# Altium project mV_Meter.PrjPcb (part 1 of 2)
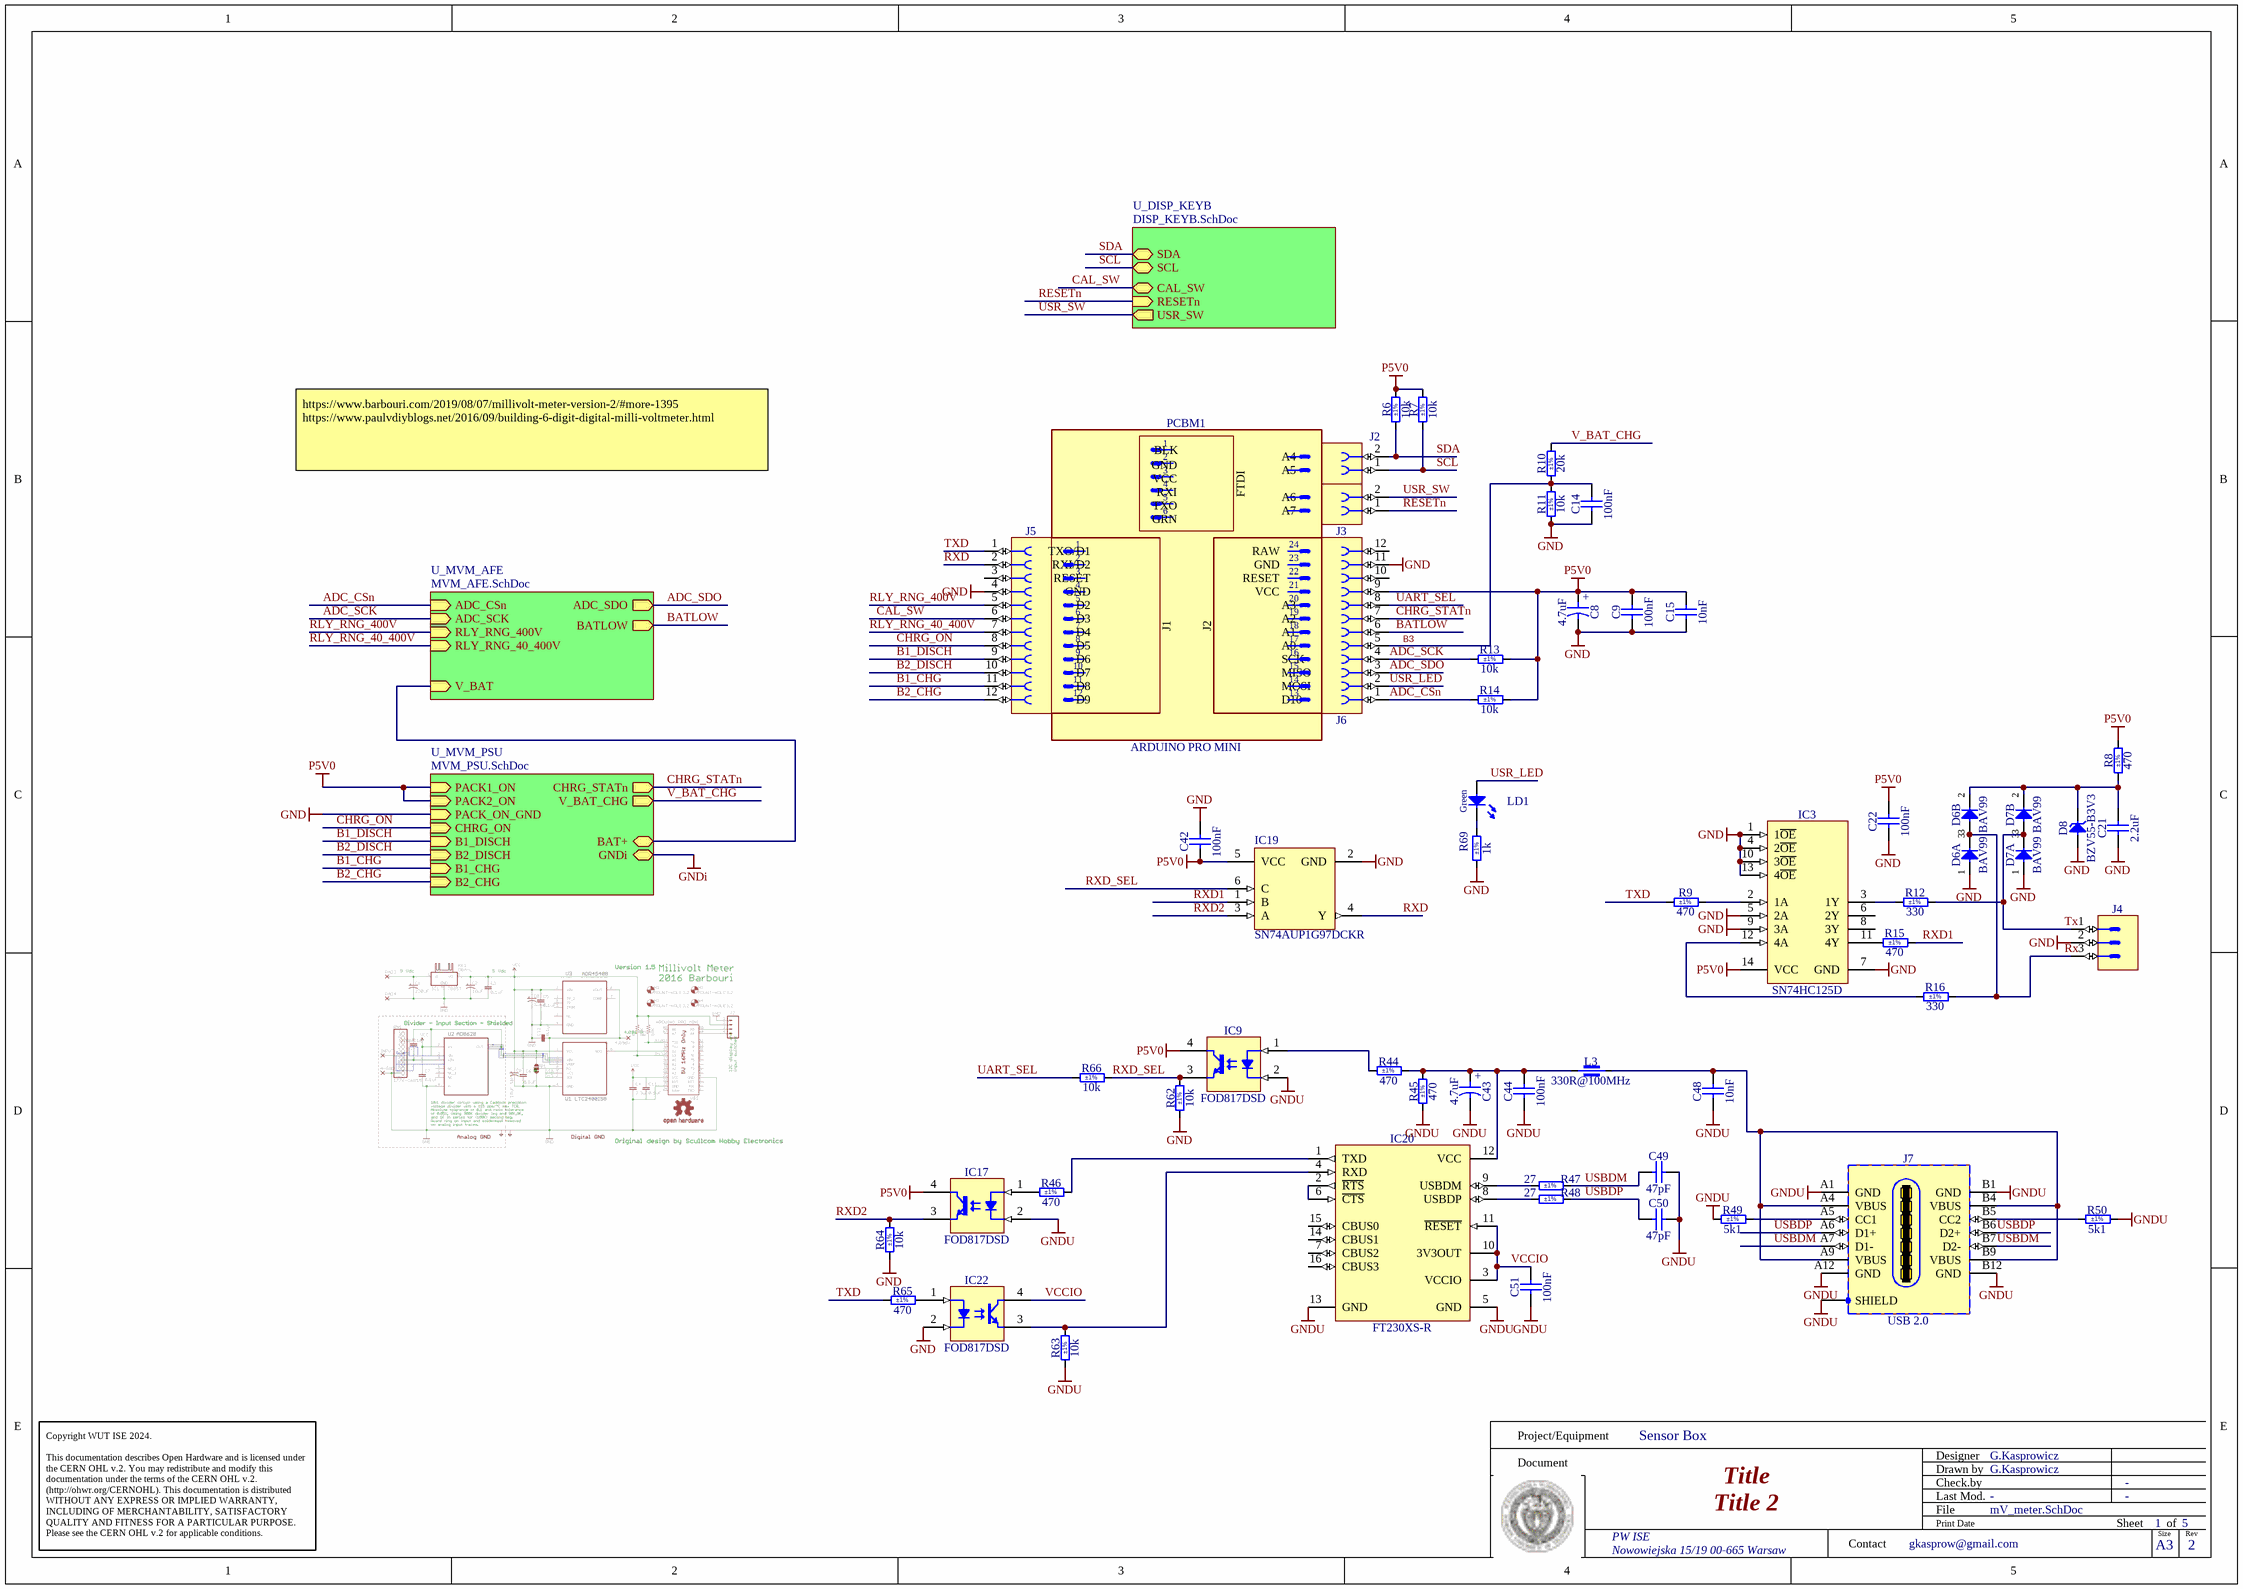
[diagram p0: mV_meter.SchDoc]
5 sheets, 260 parts. Net scope: hierarchical (ports join the sheet entries above them; power ports are global).
Board file: mV_meter.PcbDoc
Sheets:
  mV_meter.SchDoc
    U_MVM_PSU = MVM_PSU.SchDoc
      U_MVM_BMS = MVM_BMS.SchDoc
      U_MVM_BMS = MVM_BMS.SchDoc
    U_DISP_KEYB = DISP_KEYB.SchDoc
    U_MVM_AFE = MVM_AFE.SchDoc

## Sheet mV_meter.SchDoc: Title
size 420 x 297 mm; Author: G.Kasprowicz; CompanyName: WUT ISE; DrawnBy: G.Kasprowicz; Organization: WUT ISE; Address1: PW ISE; Address2: Nowowiejska 15/19 00-665 Warsaw; Address3: gkasprow@gmail.com; Revision: 2; SheetNumber: 1; SheetTotal: 5; ModifiedBy: -; CheckedDate: -; Title2: Title 2; DivGrp: WUT ISE; Designer: G.Kasprowicz; ModifiedDate: -; ProjectName: Sensor Box

### Parts
(Parts that share a designator on the sheet are numbered #1, #2 ... from top to bottom, then left to right.)
C8  4.7uF  [CAPMP3216X180N]
C9  100nF  [CAPC2012X88N]
C14  100nF  [CAPC2012X88N]
C15  10nF  [CAPC2012X135N]
C21  2.2uF  [CAPC1608X90N]
C22  100nF  [CAPC1608X90N]
C42  100nF  [CAPC1608X90N]
C43  4.7uF  [CAPMP3216X180N]
C44  100nF  [CAPC1608X90N]
C48  10nF  [CAPC2012X135N]
C49  47pF  [CAPC1608X87N]
C50  47pF  [CAPC1608X87N]
C51  100nF  [CAPC1608X90N]
D6  BAV99  [SOT95P240X110-3N]  (parts A,B of 2)
D7  BAV99  [SOT95P240X110-3N]  (parts A,B of 2)
D8  BZV55-B3V3  [DIOMELF3515N]
IC3#1  SN74HC125D  [SOIC127P600X175-14N]
IC9  FOD817DSD  [FAIRCHILD_FOD817DSD]
IC17#1  FOD817DSD  [FAIRCHILD_FOD817DSD]
IC19  SN74AUP1G97DCKR  [DCK0006A_M]
IC20  FT230XS-R  [SOP63P600X175-16N]
IC22  FOD817DSD  [FAIRCHILD_FOD817DSD]
J2#1  Socket 2  [SAMTEC_SSW-102-02-G-S]  (value not drawn)
J3  Socket 2  [SAMTEC_SSW-102-02-G-S]  (value not drawn)
J4#1  (no value)  [PHOENIX_1803280]
J5  Socket 12  [SAMTEC_SSW-112-01-G-S]  (value not drawn)
J6  Socket 12  [SAMTEC_SSW-112-01-G-S]  (value not drawn)
J7  USB 2.0  [KYCON_KUSBX-SL-CS1N14-B]
L3  330R@100MHz  [INDC1608X75N]
LD1  Green  [LED_AVAGO_HSME-C110]
PCBM1  ARDUINO PRO MINI  [PCBM_ARDUINO PRO MINI]
R6  10k  Tolerance: ±1%  [RESC1608X55N]
R7#1  10k  Tolerance: ±1%  [RESC1608X55N]
R8  470  Tolerance: ±1%  [RESC1608X55N]
R9  470  Tolerance: ±1%  [RESC1608X55N]
R10  20k  Tolerance: ±1%  [RESC1608X55N]
R11  10k  Tolerance: ±1%  [RESC1608X55N]
R12  330  Tolerance: ±1%  [RESC1608X55N]
R13  10k  Tolerance: ±1%  [RESC1608X55N]
R14  10k  Tolerance: ±1%  [RESC1608X55N]
R15  470  Tolerance: ±1%  [RESC1608X55N]
R16  330  Tolerance: ±1%  [RESC1608X55N]
R44  470  Tolerance: ±1%  [RESC1608X55N]
R45  470  Tolerance: ±1%  [RESC1608X55N]
R46  470  Tolerance: ±1%  [RESC1608X55N]
R47  27  Tolerance: ±1%  [RESC1608X55N]
R48  27  Tolerance: ±1%  [RESC1608X55N]
R49  5k1  Tolerance: ±1%  [RESC1608X55N]
R50  5k1  Tolerance: ±1%  [RESC1608X55N]
R62  10k  Tolerance: ±1%  [RESC1608X55N]
R63  10k  Tolerance: ±1%  [RESC1608X55N]
R64  10k  Tolerance: ±1%  [RESC1608X55N]
R65  470  Tolerance: ±1%  [RESC1608X55N]
R66  10k  Tolerance: ±1%  [RESC1608X55N]
R69  1k  Tolerance: ±1%  [RESC1608X55N]

### Sub-sheets
U_DISP_KEYB = DISP_KEYB.SchDoc: SDA (bidir), SCL (bidir), CAL_SW (bidir), RESETn (in), USR_SW (out)
U_MVM_AFE = MVM_AFE.SchDoc: ADC_CSn (in), ADC_SCK (in), ADC_SDO (out), RLY_RNG_400V (in), RLY_RNG_40_400V (in), BATLOW (out), V_BAT (in)
U_MVM_PSU = MVM_PSU.SchDoc: PACK1_ON (in), PACK2_ON (in), PACK_ON_GND (in), CHRG_ON (in), CHRG_STATn (out), B1_DISCH (in), B2_DISCH (in), B1_CHG (in), B2_CHG (in), BAT+ (bidir), GNDi (bidir), V_BAT_CHG (out)

### Nets
GND: C8.2 C9.1 C14.1 C15.1 C21.1 C22.1 C42.1 D6.1(A) D7.1(A) D8.2(A) IC3#1.1(1~{OE}) IC3#1.4(2~{OE}) IC3#1.5(2A) IC3#1.7(GND) IC3#1.9(3A) IC3#1.10(3~{OE}) IC3#1.13(4~{OE}) IC19.2(GND) IC22.2(C) J4#1.2 J5.4 J6.11 R11.1 R62.1 R64.1 R69.1 ; sheet U_MVM_PSU/PACK_ON_GND
GNDU: C43.2 C44.1 C48.1 C49.2 C50.2 C51.1 IC9.2(C) IC17#1.2(C) IC20.5(GND) IC20.13(GND) J7.A1(GND) J7.A12(GND) J7.B1(GND) J7.B12(GND) J7.SHIELD R45.1 R49.1 R50.2 R63.1
P5V0: C8.1 C9.2 C15.2 C22.2 C42.2 IC3#1.14(VCC) IC9.4(C) IC17#1.4(C) IC19.5(VCC) J6.9 R6.2 R7#1.2 R8.2 R13.2 R14.2 ; sheet U_MVM_PSU/PACK1_ON, sheet U_MVM_PSU/PACK2_ON
ADC_CSn: J6.1 R14.1 ; sheet U_MVM_AFE/ADC_CSn
ADC_SCK: J6.4 R13.1 ; sheet U_MVM_AFE/ADC_SCK
ADC_SDO: J6.3 ; sheet U_MVM_AFE/ADC_SDO
B1_CHG: J5.11 ; sheet U_MVM_PSU/B1_CHG
B1_DISCH: J5.9 ; sheet U_MVM_PSU/B1_DISCH
B2_CHG: J5.12 ; sheet U_MVM_PSU/B2_CHG
B2_DISCH: J5.10 ; sheet U_MVM_PSU/B2_DISCH
B3: C14.2 J6.5 R10.1 R11.2
BAT+: sheet U_MVM_PSU/BAT+, sheet U_MVM_AFE/V_BAT
BATLOW: J6.6 ; sheet U_MVM_AFE/BATLOW
CAL_SW: J5.6 ; sheet U_DISP_KEYB/CAL_SW
CHRG_ON: J5.8 ; sheet U_MVM_PSU/CHRG_ON
CHRG_STATn: J6.7 ; sheet U_MVM_PSU/CHRG_STATn
RESETn: J3.1 ; sheet U_DISP_KEYB/RESETn
RLY_RNG_40_400V: J5.7 ; sheet U_MVM_AFE/RLY_RNG_40_400V
RLY_RNG_400V: J5.5 ; sheet U_MVM_AFE/RLY_RNG_400V
Rx: D6.3(COMAC) J4#1.3 R16.2
RXD: IC19.4(Y) J5.2
RXD1: IC19.1(B) R15.2
RXD2: IC17#1.3(E) IC19.3(A) R64.2
RXD_SEL: IC9.3(E) IC19.6(C) R62.2 R66.2
SCL: J2#1.1 R7#1.1 ; sheet U_DISP_KEYB/SCL
SDA: J2#1.2 R6.1 ; sheet U_DISP_KEYB/SDA
Tx: D7.3(COMAC) J4#1.1 R12.2
TXD: J5.1 R9.1 R65.1
UART_SEL: J6.8 R66.1
USBDM: C49.1 J7.A7(D1-) J7.B7(D2-) R47.2
USBDP: C50.1 J7.A6(D1+) J7.B6(D2+) R48.2
USR_LED: J6.2 LD1.2(A)
USR_SW: J3.2 ; sheet U_DISP_KEYB/USR_SW
V_BAT_CHG: R10.2 ; sheet U_MVM_PSU/V_BAT_CHG
VCCIO: C51.2 IC20.3(VCCIO) IC20.10(3V3OUT) IC20.11(~{RESET}) IC22.4(C)
NetC21_2: C21.2 D6.2(C) D7.2(C) D8.1(C) R8.1
NetC43_1: C43.1 C44.2 IC20.12(VCC) L3.1 R44.2 R45.2
NetC48_2: C48.2 J7.A4(VBUS) J7.A9(VBUS) J7.B4(VBUS) J7.B9(VBUS) L3.2
NetIC3#1_2: IC3#1.2(1A) R9.2
NetIC3#1_3: IC3#1.3(1Y) R12.1
NetIC3#1_11: IC3#1.11(4Y) R15.1
NetIC3#1_12: IC3#1.12(4A) R16.1
NetIC9_1: IC9.1(A) R44.1
NetIC17#1_1: IC17#1.1(A) R46.1
NetIC20_1: IC20.1(TXD) R46.2
NetIC20_2: IC20.2(~{RTS}) IC20.6(~{CTS})
NetIC20_4: IC20.4(RXD) IC22.3(E) R63.2
NetIC20_8: IC20.8(USBDP) R48.1
NetIC20_9: IC20.9(USBDM) R47.1
NetIC22_1: IC22.1(A) R65.2
NetJ7_A5: J7.A5(CC1) R49.2
NetJ7_B5: J7.B5(CC2) R50.1
NetLD1_1: LD1.1(C) R69.2

Not connected (* = marked no-connect by the designer): IC3#1 6(2Y) 8(3Y); IC20 7(CBUS2) 14(CBUS1) 15(CBUS0) 16(CBUS3); J5 3; J6 10 12

### Notes on the sheet
- https://www.barbouri.com/2019/08/07/millivolt-meter-version-2/#more-1395
  https://www.paulvdiyblogs.net/2016/09/building-6-digit-digital-milli-voltmeter.html
- Project/Equipment
- Document
- Designer
- Drawn by
- Check.by
- Copyright WUT ISE 2024.
  This documentation describes Open Hardware and is licensed under the CERN OHL v.2. You may redistribute and modify this documentation under the terms of the CERN OHL v.2. (http://ohwr.org/CERNOHL). This documentation is distributed WITHOUT ANY EXPRESS OR IMPLIED WARRANTY, INCLUDING OF MERCHANTABILITY, SATISFACTORY QUALITY AND FITNESS FOR A PARTICULAR PURPOSE. Please see the CERN OHL v.2 for applicable conditions.
- Contact
- File
- Last Mod.
- Print Date
- Sheet
- Size
- A3
- of
- Rev
- (in symbol CTE3216-18_4.7UF_10V_10%_LESR1400) +
- (in symbol PCBM_ARDUINO PRO MINI extra pins) 1; BLK; 2; A4; GND; 3; A5; VCC; 4; FTDI; RXI; 5; A6; TXO; 6; A7; GRN; 24; TXO/D1; RAW; 23; RXI/D2; 22; RESET; 21; 20; D2; A3; 19; D3; A2; 7; J1; J2; 18; D4; A1; 8; 17; D5; A0; 9; 16; D6; SCK; 10; 15; D7; MISO; 11; 14; D8; MOSI; 12; 13; D9; D10

### Library data of the parts
C8 C43 = CTE3216-18_4.7UF_10V_10%_LESR1400: Polarised capacitor; Part Description: Low ESR 1R4 Solid Tantalum Chip Capacitor; Manufacturer: GENERIC; Manufacturer1 Part Number: TPSA475K010R1400; Voltage: 10V; Tolerance: ±10%; Part Number: CTE3216-18_4.7UF_10V_10%_LESR1400; Component Kind: Standard; Component Type: Standard; Pin Count: 2; Value: 4.7uF; Status: Preferred; Manufacturer Part Number: CTE3216-18_4.7UF_10V_10%_LESR1400; Case: A; Mounted: Yes; Socket: No; SMD: Yes; Sense: No; Manufacturer1 Example: AVX; Manufacturer1 ComponentHeight: 1.8mm; HelpURL: \\cern.ch\dfs\Applications\Altium\Datasheets\CTE-LESR_AVX_TPS.pdf; Author: CERN DEM JLC; CreateDate: 05.05.2008; LatestRevisionDate: 20.01.2009
C9 C14 = CC0805_100NF_50V_1%_NP0: Non-polarised capacitor; Part Description: SMD Multilayer Chip Ceramic Capacitor; Manufacturer: GENERIC; Manufacturer1 Part Number: 0805N103F500C; Voltage: 50V; TC: C0G/NP0; Tolerance: ±1%; Part Number: CC0805_100NF_50V_1%_NP0; Component Kind: Standard; Component Type: Standard; Footprint: CAPC2012X135N; Pin Count: 2; Value: 100nF; Status: Not Recommended; Manufacturer Part Number: CC0805_100NF_50V_1%_NP0; Case: 0805; Mounted: Yes; Socket: No; SMD: Yes; Sense: No; ComponentHeight: 1.35mm; Manufacturer1 Example: WALSIN TECHNOLOGY CORPORATION; Manufacturer1 ComponentHeight: 1.35mm; HelpURL: \\cern.ch\dfs\Applications\Altium\Datasheets\CC0805_WALSIN_0805.pdf; Author: CERN DEM HF; CreateDate: 28.08.2023; LatestRevisionDate: 28.08.2023
C15 C48 = CC0805_10NF_50V_5%_C0G: Non-polarised capacitor; Part Description: SMD Multilayer Chip Ceramic Capacitor; Manufacturer: GENERIC; Manufacturer1 Part Number: C0805C103J5GACTU; Voltage: 50V; TC: C0G/NP0; Tolerance: ±5%; Part Number: CC0805_10NF_50V_5%_C0G; Component Kind: Standard; Component Type: Standard; Pin Count: 2; Value: 10nF; Status: None; Manufacturer Part Number: CC0805_10NF_50V_5%_C0G; Case: 0805; Mounted: Yes; Socket: No; SMD: Yes; Sense: No; Manufacturer1 Example: KEMET; Manufacturer1 ComponentHeight: 0.88mm; HelpURL: \\cern.ch\dfs\Applications\Altium\Datasheets\CC0805_C0G_KEMET_(Commercial Grade).pdf; Author: CERN DEM JLC; CreateDate: 02.02.2011; LatestRevisionDate: 22.04.2015
C21 = CC0603_2.2UF_10V_20%_X7R: Non-polarised capacitor; Part Description: SMD Multilayer Chip Ceramic Capacitor; Manufacturer: GENERIC; Manufacturer1 Part Number: LMK107B7225MA-T; Voltage: 10V; TC: X7R; Tolerance: ±20%; Part Number: CC0603_2.2UF_10V_20%_X7R; Component Kind: Standard; Component Type: Standard; Pin Count: 2; Value: 2.2uF; Status: Not Recommended; Manufacturer Part Number: CC0603_2.2UF_10V_20%_X7R; Case: 0603; Mounted: Yes; Socket: No; SMD: Yes; Sense: No; Manufacturer1 Example: TAIYO YUDEN; Manufacturer1 ComponentHeight: 0.9mm; HelpURL: \\cern.ch\dfs\Applications\Altium\Datasheets\CC0603_X7R_TAIYO-YUDEN_HIGH-VALUE.pdf; Author: CERN DEM JLC; CreateDate: 22.06.2011; LatestRevisionDate: 27.06.2011
C22 C42 C44 C51 = CC0603_100NF_100V_10%_X7R: Non-polarised capacitor; Part Description: SMD Multilayer Chip Ceramic Capacitor; Manufacturer: GENERIC; Manufacturer1 Part Number: GRM188R72A104KA35D; Voltage: 100V; TC: X7R; Tolerance: ±10%; Part Number: CC0603_100NF_100V_10%_X7R; Component Kind: Standard; Component Type: Standard; Pin Count: 2; Value: 100nF; Status: None; Manufacturer Part Number: CC0603_100NF_100V_10%_X7R; Case: 0603; Mounted: Yes; Socket: No; SMD: Yes; Sense: No; Manufacturer1 Example: MURATA; Manufacturer1 ComponentHeight: 0.9mm; HelpURL: \\cern.ch\dfs\Applications\Altium\Datasheets\CC0603_MURATA_GRM188R72A104KA35D.pdf; Author: CERN DEM JLC; CreateDate: 11.12.2013; LatestRevisionDate: 11.12.2013
C49 C50 = CC0603_47PF_50V_5%_NP0: Non-polarised capacitor; Part Description: SMD Multilayer Chip Ceramic Capacitor; Manufacturer: GENERIC; Manufacturer1 Part Number: 223886715479; Voltage: 50V; TC: C0G/NP0; Tolerance: ±5%; Part Number: CC0603_47PF_50V_5%_NP0; Component Kind: Standard; Component Type: Standard; Pin Count: 2; Value: 47pF; Status: Preferred; Manufacturer Part Number: CC0603_47PF_50V_5%_NP0; Case: 0603; Mounted: Yes; Socket: No; SMD: Yes; Sense: No; Manufacturer1 Example: PHYCOMP; Manufacturer1 ComponentHeight: 0.87mm; HelpURL: \\cern.ch\dfs\Applications\Altium\Datasheets\CC0603_NP0_PHYCOMP.pdf; Author: CERN DEM JLC; CreateDate: 03.12.2007; LatestRevisionDate: 03.12.2007
D6 D7 = BAV99: Serial Diode; Part Description: Dual Series Signal Diode; Manufacturer: FAIRCHILD SEMICONDUCTOR; Voltage: 70V; Power: 350mW; PressFit: No; Bonding: No; Part Number: BAV99; Component Kind: Standard; Component Type: Standard; Device: BAV99; PackageDescription: SOT, 0.95mm Pitch; 3 Pin, 1.40mm W X 3.00mm L X 1.10mm H body, IPC Medium Density; Manufacturer Part Number: BAV99; Pin Count: 3; Case: SOT23-3; Mounted: Yes; Socket: No; SMD: Yes; Sense: No; ComponentHeight: 1.1mm; HelpURL: \\cern.ch\dfs\Applications\Altium\Datasheets\BAV99.pdf; Author: CERN DEM JLC; CreateDate: 06.05.2008; LatestRevisionDate: 27.09.2012
D8 = BZV55-B3V3: Zener Diode; Part Description: Voltage Regulator Diode; Manufacturer: NEXPERIA; Voltage: 3V3; Power: 500mW; PressFit: No; Bonding: No; Part Number: BZV55-B3V3; Component Kind: Standard; Component Type: Standard; Device: BZV55-B3V3; PackageDescription: SOD80C, MELF Diode, 2-Leads, Body 3.5x1.5mm, IPC Medium Density; Manufacturer Part Number: BZV55-B3V3; Pin Count: 2; Case: SOD-80C; Mounted: Yes; Socket: No; SMD: Yes; Sense: No; ComponentHeight: 1.6mm; HelpURL: \\cern.ch\dfs\Applications\Altium\Datasheets\BZV55.pdf; Author: CERN DEM JLC; CreateDate: 06.05.2008; LatestRevisionDate: 22.01.2018
IC3#1 = SN74HC125D: Quadruple Bus Buffer with 3-State Outputs; Manufacturer: TEXAS INSTRUMENTS; PressFit: No; Bonding: No; Part Number: SN74HC125D; Component Kind: Standard; Component Type: Standard; Device: SN74HC125D; PackageDescription: SOIC 14, Pitch 1.27mm - Body 4x8.75mm, IPC Medium Density; Part Description: Quadruple Bus Buffer with 3-State Outputs; Manufacturer Part Number: SN74HC125D; Pin Count: 14; Case: SOIC14; Mounted: Yes; Socket: No; SMD: Yes; Sense: No; ComponentHeight: 1.75mm; Author: CERN DEM JLC; HelpURL: \\cern.ch\dfs\Applications\Altium\Datasheets\SN74HC125D.pdf; CreateDate: 30.06.2011; LatestRevisionDate: 30.06.2011
IC9 IC17#1 IC22 = FOD817DSD: Single Optocoupler; Part Description: 4-Pin High Operating Temperature Phototransistor Optocoupler; Manufacturer: FAIRCHILD SEMICONDUCTOR; PressFit: No; Bonding: No; Part Number: FOD817DSD; Component Kind: Standard; Component Type: Standard; Device: FOD817DSD; PackageDescription: SOIC, 2.54mm Pitch; 4 Pin, 6.50mm W X 4.60mm L X 4.60mm H body; Manufacturer Part Number: FOD817DSD; Pin Count: 4; Case: SOIC4; Mounted: Yes; Socket: No; SMD: Yes; Sense: No; ComponentHeight: 4.6mm; HelpURL: \\cern.ch\dfs\Applications\Altium\Datasheets\FOD817DSD.pdf; Author: CERN DEM JLC; CreateDate: 21.07.2014; LatestRevisionDate: 21.07.2014
IC19 = CMP-0859-00523-3: Low-Power Configurable Multiple-Function Gate, DCK0006A, LARGE T&R; Manufacturer: Texas Instruments; VCC(Min)(V): 0.8; Logic: True; Output Drive (IOL/IOH)(Max)(mA): 20/-20; 3-State Output: No; Voltage(Nom)(V): 0.8,1.2,1.5,1.8,2.5,3.3; Output Type: CMOS; Rating: Catalog; Technology Family: AUP; VCC(Max)(V): 3.6; Sub-Family: Configurable Logic; Bits(#): 1; ICC @ Nom Voltage(Max)(mA): 0.0009; tpd @ Nom Voltage(Max)(ns): 36.7,21.4,14.8,11.8,8.8,7.3; F @ Nom Voltage(Max)(Mhz): 100; DatasheetVersion: SCES505J; Gate Type: Configurable; Operating Temperature Range(C): -40 to 85; Generic Part Number: SN74AUP1G97; PackageReference: DCK0006A; Schmitt Trigger: No; Input Type: CMOS
IC20 = FT230XS-R: USB To Basic UART IC; Part Description: USB to Serial UART Interface; Manufacturer: FUTURE TECHNOLOGY DEVICES INTERNATIONAL (FTDI); PressFit: No; Bonding: No; Part Number: FT230XS-R; Component Kind: Standard; Component Type: Standard; Device: FT230XS-R; PackageDescription: SOP, 0.635mm Pitch; 16 Pin, 3.9mm W X 4.895mm L X 1.75mm H body, IPC Medium Density; Manufacturer Part Number: FT230XS-R; Pin Count: 16; Case: SSOP16; Mounted: Yes; Socket: No; SMD: Yes; Sense: No; ComponentHeight: 1.75mm; Author: CERN DEM JLC; HelpURL: \\cern.ch\dfs\Applications\Altium\Datasheets\FT230XS-R.pdf; CreateDate: 12.02.2013; LatestRevisionDate: 12.02.2013
J2#1 J3 = SAMTEC_SSW-102-02-G-S: Connector 2 Female; Part Description: 2 Contacts, Pitch 2.54mm, Single Row Through Mount Straight Socket (Lead Length 4.93mm); Manufacturer: SAMTEC; PressFit: No; Part Number: SAMTEC_SSW-102-02-G-S; Component Kind: Standard; Component Type: Standard; Pin Count: 2; Family: Socket 2; Mounted: Yes; Socket: No; SMD: No; Sense: No; Status: None; Manufacturer Part Number: SSW-102-02-G-S; ComponentHeight: 8.51mm; HelpURL: \\cern.ch\dfs\Applications\Altium\Datasheets\SAMTEC_SSW-102-02-G-S.pdf; Author: CERN DEM JLC; CreateDate: 27.01.2011; LatestRevisionDate: 27.01.2011
J4#1 = PHOENIX_1803280: Connector 3 Male; Part Description: 8A 160 V, Pitch: 3.81mm, 3 Positions  Right Angled Header; Manufacturer: PHOENIX CONTACT; Manufacturer Part Number: 1803277 (MC 1,5/ 3-G-3,81); PressFit: No; Part Number: PHOENIX_1803280; Component Kind: Standard; Component Type: Standard; Pin Count: 3; Mounted: Yes; Socket: No; SMD: No; Sense: No; Status: None; ComponentHeight: 7.25mm; HelpURL: \\cern.ch\dfs\Applications\Altium\Datasheets\PHOENIX_1803280.pdf; Author: CERN DEM BC; CreateDate: 23.09.2019; LatestRevisionDate: 23.09.2019
J5 J6 = SAMTEC_SSW-112-01-G-S: Connector 12 Female; Part Description: 12 Contacts, Pitch 2.54mm, Single Row Through Mount Straight Socket (Lead Length 2.64mm); Manufacturer: SAMTEC; PressFit: No; Part Number: SAMTEC_SSW-112-01-G-S; Component Kind: Standard; Component Type: Standard; Pin Count: 12; Family: Socket 12; Mounted: Yes; Socket: No; SMD: No; Sense: No; Status: None; Manufacturer Part Number: SSW-112-01-G-S; ComponentHeight: 8.51mm; HelpURL: \\cern.ch\dfs\Applications\Altium\Datasheets\SAMTEC_SSW-112-01-G-S.pdf; Author: CERN DEM BR; CreateDate: 30.04.2019; LatestRevisionDate: 30.04.2019
J7 = KYCON_KUSBX-SL-CS1N14-B: 2x7 Pin + 1 Shield  USB Type C Receptacle; Part Description: USB 2.0 Type C Receptacle, High Temp., Flag Style Through Hole 14 Pin, Black; Manufacturer: KYCON; PressFit: No; Part Number: KYCON_KUSBX-SL-CS1N14-B; Component Kind: Standard; Component Type: Standard; Pin Count: 18; Family: USB 2.0; Mounted: Yes; Socket: No; SMD: No; Sense: No; Status: None; Manufacturer Part Number: KUSBX-SL-CS1N14-B; ComponentHeight: 8.34mm; HelpURL: \\cern.ch\dfs\Applications\Altium\Datasheets\KYCON_KUSBX-SL-CS1N14-B.pdf; Author: CERN DEM BC; CreateDate: 03.11.2020; LatestRevisionDate: 03.11.2020
L3 = IND0603_TDK_MPZ1608S331ATA00: Part Description: SMT Chip Bead for Power Line; Manufacturer: TDK; Power: 1.7A; Resistance: 0.08R; Tolerance: ±25%; Part Number: IND0603_TDK_MPZ1608S331ATA00; Component Kind: Standard; Component Type: Standard; Pin Count: 2; Value: 330R@100MHz; Manufacturer Part Number: MPZ1608S331ATA00; Case: 0603; Mounted: Yes; Socket: No; SMD: Yes; Sense: No; ComponentHeight: 0.8mm; HelpURL: \\cern.ch\dfs\Applications\Altium\Datasheets\IND0603_TDK_MPZ1608.pdf; Author: CERN DEM JLC; CreateDate: 10.01.2018; LatestRevisionDate: 25.10.2018
LD1 = LED_AVAGO_HSME-C110: LED Green 1C 2A; Part Description: High Performance Right Angle Chip Green LED; Manufacturer: AVAGO TECHNOLOGIES; PressFit: No; Bonding: No; Part Number: LED_AVAGO_HSME-C110; Component Kind: Standard; Component Type: Standard; Color: Green; PackageDescription: Green Chip LED, 2-Leads, Body 3.3x1.6mm, Side Emitting Package; Manufacturer Part Number: HSME-C110; Pin Count: 2; Case: 1206; Mounted: Yes; Socket: No; SMD: Yes; Sense: No; ComponentHeight: 1.1mm; HelpURL: \\cern.ch\dfs\Applications\Altium\Datasheets\LED_AVAGO_HSME-C110.pdf; ComponentLink1URL: \\cern.ch\dfs\Applications\Altium\Datasheets\LED_AVAGO_HSME-C110_DESIGN-GUIDE.pdf; ComponentLink1Description: Design Guide; Author: CERN DEM JMW; CreateDate: 30.07.2009; LatestRevisionDate: 20.06.2012
PCBM1 = PCBM_ARDUINO PRO MINI extra pins: Arduino PRO MINI Printed Circuit Board Module; PressFit: No; Bonding: No; Part Number: PCBM_ARDUINO PRO MINI; Component Kind: Accessories; Component Type: Standard; Device: ARDUINO PRO MINI; PackageDescription: Microcontroller Board Arduino PRO MINI; Part Description: Arduino PRO MINI Printed Circuit Board Module; Manufacturer: ARDUINO; Manufacturer Part Number: ARDUINO PRO MINI; Pin Count: 0; Mounted: Yes; Socket: No; SMD: No; Sense: No; ComponentHeight: 15.4mm; Author: CERN DEM HF; HelpURL: \\cern.ch\dfs\Applications\Altium\Datasheets\PCBM_ARDUINO PRO MINI.pdf; CreateDate: 06.09.2022; LatestRevisionDate: 06.09.2022
R6 R7#1 R11 R13 R14 R62-R64 R66 = R0603_10K_1%_0.1W_100PPM: Resistor - 1%; Part Description: General Purpose Thick Film Chip Resistor; Manufacturer: GENERIC; Manufacturer1 Part Number: NRC06F1002TRF; Power: 0.1W; TC: ±100ppm/°C; PressFit: No; Part Number: R0603_10K_1%_0.1W_100PPM; Component Kind: Standard; Component Type: Standard; Pin Count: 2; Value: 10k; Status: Preferred; Manufacturer Part Number: R0603_10K_1%_0.1W_100PPM; Case: 0603; Mounted: Yes; Sense: No; Socket: No; SMD: Yes; Manufacturer1 Example: NIC COMPONENT; Manufacturer1 ComponentHeight: 0.55mm; HelpURL: \\cern.ch\dfs\Applications\Altium\Datasheets\R0603_NIC_NRC.pdf; Author: CERN DEM JLC; CreateDate: 03.12.2007; LatestRevisionDate: 13.03.2008
R8 R9 R15 R44-R46 R65 = R0603_470R_1%_0.1W_100PPM: Resistor - 1%; Part Description: General Purpose Thick Film Chip Resistor; Manufacturer: GENERIC; Manufacturer1 Part Number: NRC06F4700TRF; Power: 0.1W; TC: ±100ppm/°C; PressFit: No; Part Number: R0603_470R_1%_0.1W_100PPM; Component Kind: Standard; Component Type: Standard; Pin Count: 2; Value: 470; Status: Preferred; Manufacturer Part Number: R0603_470R_1%_0.1W_100PPM; Case: 0603; Mounted: Yes; Sense: No; Socket: No; SMD: Yes; Manufacturer1 Example: NIC COMPONENT; Manufacturer1 ComponentHeight: 0.55mm; HelpURL: \\cern.ch\dfs\Applications\Altium\Datasheets\R0603_NIC_NRC.pdf; Author: CERN DEM JLC; CreateDate: 03.12.2007; LatestRevisionDate: 13.03.2008
R10 = R0603_20K_1%_0.1W_100PPM: Resistor - 1%; Part Description: General Purpose Thick Film Chip Resistor; Manufacturer: GENERIC; Manufacturer1 Part Number: NRC06F2002TRF; Power: 0.1W; TC: ±100ppm/°C; PressFit: No; Part Number: R0603_20K_1%_0.1W_100PPM; Component Kind: Standard; Component Type: Standard; Pin Count: 2; Value: 20k; Status: Preferred; Manufacturer Part Number: R0603_20K_1%_0.1W_100PPM; Case: 0603; Mounted: Yes; Sense: No; Socket: No; SMD: Yes; Manufacturer1 Example: NIC COMPONENT; Manufacturer1 ComponentHeight: 0.55mm; HelpURL: \\cern.ch\dfs\Applications\Altium\Datasheets\R0603_NIC_NRC.pdf; Author: CERN DEM JLC; CreateDate: 03.12.2007; LatestRevisionDate: 13.03.2008
R12 R16 = R0603_330R_1%_0.1W_100PPM: Resistor - 1%; Part Description: General Purpose Thick Film Chip Resistor; Manufacturer: GENERIC; Manufacturer1 Part Number: NRC06F3300TRF; Power: 0.1W; TC: ±100ppm/°C; PressFit: No; Part Number: R0603_330R_1%_0.1W_100PPM; Component Kind: Standard; Component Type: Standard; Pin Count: 2; Value: 330; Status: Preferred; Manufacturer Part Number: R0603_330R_1%_0.1W_100PPM; Case: 0603; Mounted: Yes; Sense: No; Socket: No; SMD: Yes; Manufacturer1 Example: NIC COMPONENT; Manufacturer1 ComponentHeight: 0.55mm; HelpURL: \\cern.ch\dfs\Applications\Altium\Datasheets\R0603_NIC_NRC.pdf; Author: CERN DEM JLC; CreateDate: 03.12.2007; LatestRevisionDate: 13.03.2008
R47 R48 = R0603_27R_1%_0.1W_100PPM: Resistor - 1%; Part Description: General Purpose Thick Film Chip Resistor; Manufacturer: GENERIC; Manufacturer1 Part Number: NRC06F27R0TRF; Power: 0.1W; TC: ±100ppm/°C; PressFit: No; Part Number: R0603_27R_1%_0.1W_100PPM; Component Kind: Standard; Component Type: Standard; Pin Count: 2; Value: 27; Status: Preferred; Manufacturer Part Number: R0603_27R_1%_0.1W_100PPM; Case: 0603; Mounted: Yes; Sense: No; Socket: No; SMD: Yes; Manufacturer1 Example: NIC COMPONENT; Manufacturer1 ComponentHeight: 0.55mm; HelpURL: \\cern.ch\dfs\Applications\Altium\Datasheets\R0603_NIC_NRC.pdf; Author: CERN DEM JLC; CreateDate: 03.12.2007; LatestRevisionDate: 13.03.2008
R49 R50 = R0603_5K1_1%_0.1W_100PPM: Resistor - 1%; Part Description: General Purpose Thick Film Chip Resistor; Manufacturer: GENERIC; Manufacturer1 Part Number: NRC06F5101TRF; Power: 0.1W; TC: ±100ppm/°C; PressFit: No; Part Number: R0603_5K1_1%_0.1W_100PPM; Component Kind: Standard; Component Type: Standard; Pin Count: 2; Value: 5k1; Status: Preferred; Manufacturer Part Number: R0603_5K1_1%_0.1W_100PPM; Case: 0603; Mounted: Yes; Sense: No; Socket: No; SMD: Yes; Manufacturer1 Example: NIC COMPONENT; Manufacturer1 ComponentHeight: 0.55mm; HelpURL: \\cern.ch\dfs\Applications\Altium\Datasheets\R0603_NIC_NRC.pdf; Author: CERN DEM JLC; CreateDate: 03.12.2007; LatestRevisionDate: 13.03.2008
R69 = R0603_1K_1%_0.1W_100PPM: Resistor - 1%; Part Description: General Purpose Thick Film Chip Resistor; Manufacturer: GENERIC; Manufacturer1 Part Number: NRC06F1001TRF; Power: 0.1W; TC: ±100ppm/°C; PressFit: No; Part Number: R0603_1K_1%_0.1W_100PPM; Component Kind: Standard; Component Type: Standard; Pin Count: 2; Value: 1k; Status: Preferred; Manufacturer Part Number: R0603_1K_1%_0.1W_100PPM; Case: 0603; Mounted: Yes; Sense: No; Socket: No; SMD: Yes; Manufacturer1 Example: NIC COMPONENT; Manufacturer1 ComponentHeight: 0.55mm; HelpURL: \\cern.ch\dfs\Applications\Altium\Datasheets\R0603_NIC_NRC.pdf; Author: CERN DEM JLC; CreateDate: 03.12.2007; LatestRevisionDate: 13.03.2008

## Sheet MVM_PSU.SchDoc: Title
size 420 x 297 mm; Author: G.Kasprowicz; CompanyName: WUT ISE; DrawnBy: G.Kasprowicz; Organization: WUT ISE; Address1: PW ISE; Address2: Nowowiejska 15/19 00-665 Warsaw; Address3: gkasprow@gmail.com; Revision: 2; SheetNumber: -; SheetTotal: -; ModifiedBy: -; CheckedDate: -; Title2: Title 2; DivGrp: WUT ISE; Designer: G.Kasprowicz; ModifiedDate: -; ProjectName: Sensor Box
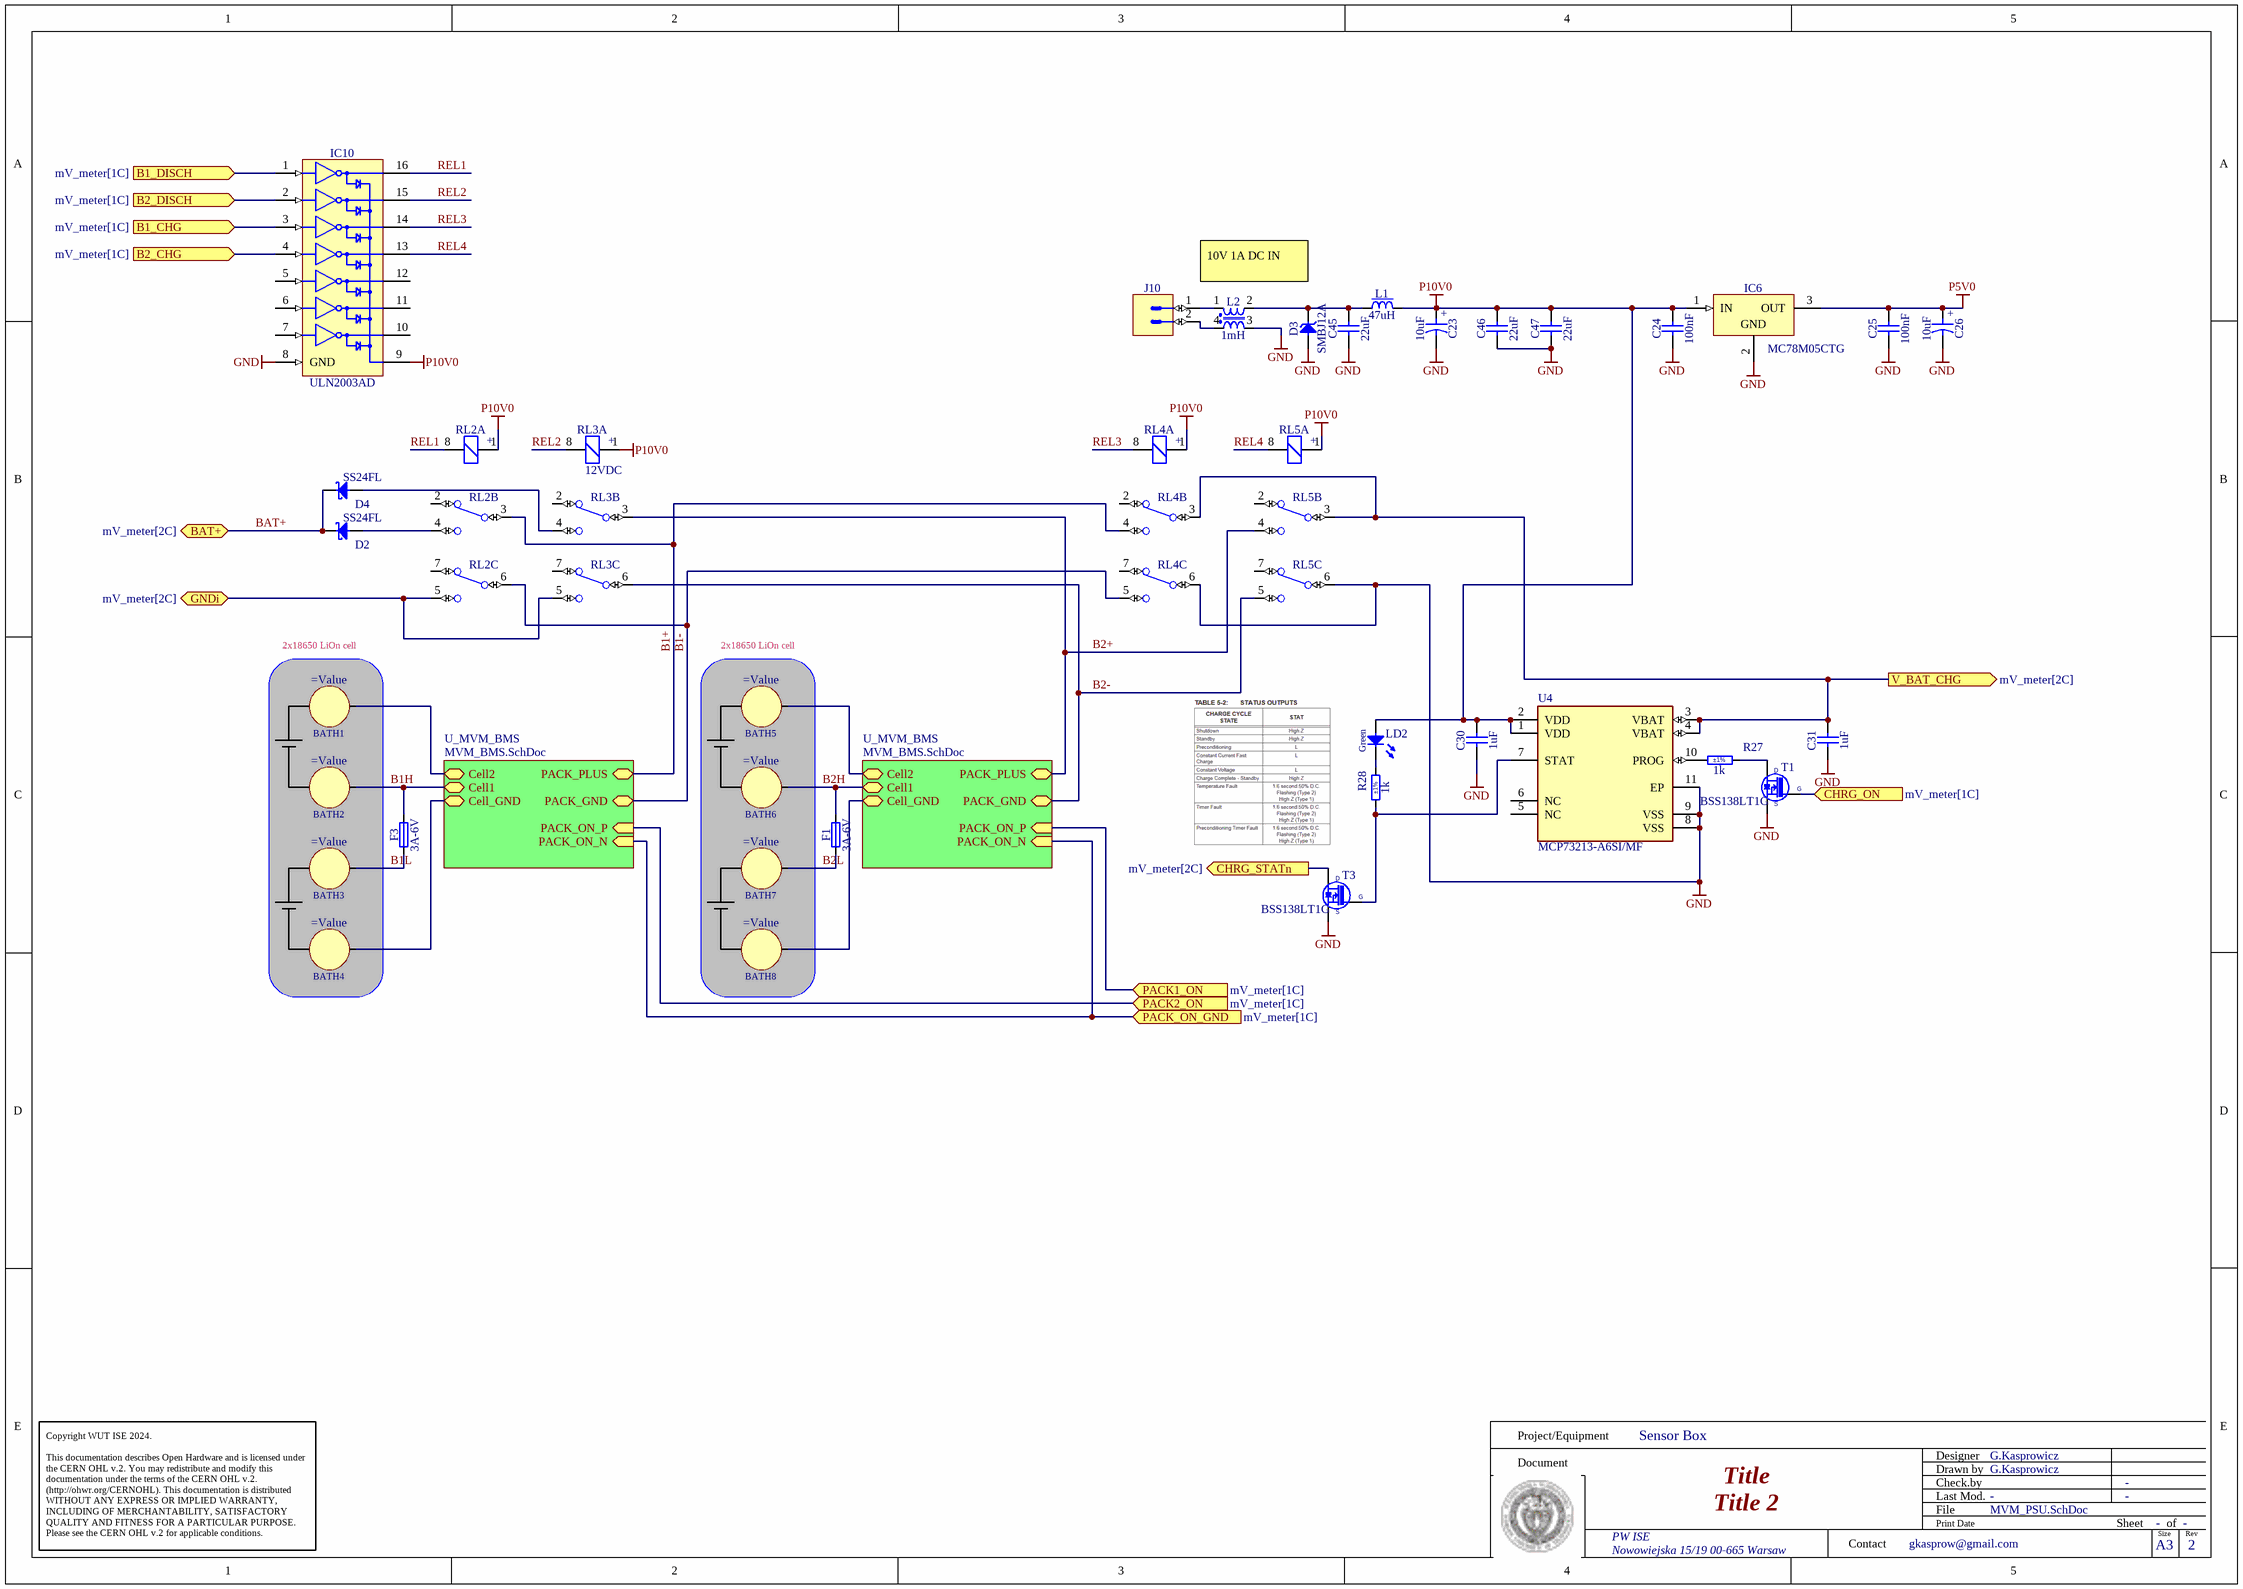
[diagram p1: MVM_PSU.SchDoc]

### Parts
BATH1  (no value)  [BATH_KEYSTONE_54]
BATH2  (no value)  [BATH_KEYSTONE_54]
BATH3  (no value)  [BATH_KEYSTONE_54]
BATH4  (no value)  [BATH_KEYSTONE_54]
BATH5  (no value)  [BATH_KEYSTONE_54]
BATH6  (no value)  [BATH_KEYSTONE_54]
BATH7  (no value)  [BATH_KEYSTONE_54]
BATH8  (no value)  [BATH_KEYSTONE_54]
C23  10uF  [CAPMP3216X180N]
C24  100nF  [CAPC2012X88N]
C25  100nF  [CAPC2012X88N]
C26  10uF  [CAPMP3216X180N]
C30  1uF  [CAPC1608X87N]
C31  1uF  [CAPC1608X87N]
C45  22uF  [CAPC3216X180N]
C46  22uF  [CAPC3216X180N]
C47  22uF  [CAPC3216X180N]
D2  SS24FL  [SODFL3617X108N]
D3  SMBJ12A  [DIOM5336X265N]
D4  SS24FL  [SODFL3617X108N]
F1  3A-6V  [FUSR_BOURNS_MF-SM300]
F3  3A-6V  [FUSR_BOURNS_MF-SM300]
IC6  MC78M05CTG  [TO-220-V]
IC10  ULN2003AD  [SOIC127P600X175-16N]
J10  (no value)  [PHOENIX_1803277]
L1  47uH  [IND_WURTH_WE-LHMI_7050]
L2  1mH  [IND_BOURNS_SRF1006]
LD2  Green  [LED_AVAGO_HSME-C110]
R27  1k  Tolerance: ±1%  [RESC1608X55N]
R28  1k  Tolerance: ±1%  [RESC1608X55N]
RL2  REL_TYCO_IM Non-latching  [REL_TYCO_IMXXXGX]  (value not drawn)  (parts A,B,C of 3)
RL3  value 12VDC  [REL_TYCO_IMXXXGX]  (hidden comment: REL_TYCO_IM Non-latching)  (parts A,B,C of 3)
RL4  REL_TYCO_IM Non-latching  [REL_TYCO_IMXXXGX]  (value not drawn)  (parts A,B,C of 3)
RL5  REL_TYCO_IM Non-latching  [REL_TYCO_IMXXXGX]  (value not drawn)  (parts A,B,C of 3)
T1  BSS138LT1G  [SOT95P240X110-3N]
T3  BSS138LT1G  [SOT95P240X110-3N]
U4  MCP73213-A6SI/MF  [FP-C04-063-IPC_B]

### Blocks framed on the sheet
2x18650 LiOn cell: BATH1-BATH4
2x18650 LiOn cell: BATH5-BATH8

### Sub-sheets
U_MVM_BMS = MVM_BMS.SchDoc: Cell1 (bidir), Cell2 (bidir), Cell_GND (bidir), PACK_GND (bidir), PACK_PLUS (bidir), PACK_ON_P (in), PACK_ON_N (in)
U_MVM_BMS = MVM_BMS.SchDoc: Cell1 (bidir), Cell2 (bidir), Cell_GND (bidir), PACK_GND (bidir), PACK_PLUS (bidir), PACK_ON_P (in), PACK_ON_N (in)

### Ports
B1_CHG (in, see mV_meter[1C]), B1_DISCH (in, see mV_meter[1C]), B2_CHG (in, see mV_meter[1C]), B2_DISCH (in, see mV_meter[1C]), BAT+ (bidir, see mV_meter[2C]), CHRG_ON (in, see mV_meter[1C]), CHRG_STATn (out, see mV_meter[2C]), GNDi (bidir, see mV_meter[2C]), PACK1_ON (in, see mV_meter[1C]), PACK2_ON (in, see mV_meter[1C]), PACK_ON_GND (in, see mV_meter[1C]), V_BAT_CHG (out, see mV_meter[2C])

### Nets
GND: C23.2 C24.1 C25.1 C26.2 C30.1 C31.1 C45.1 C46.1 C47.1 D3.2(A) IC6.2(GND) IC10.8(GND) L2.3 RL4.6(C) RL5.6(C) T1.2(S) T3.2(S) U4.8(VSS) U4.9(VSS) U4.11(EP) ; port PACK_ON_GND, sheet U_MVM_BMS/PACK_ON_N, sheet U_MVM_BMS/PACK_ON_N
GNDi: RL2.5(NO) RL3.5(NO) ; port GNDi
P5V0: C25.2 C26.1 IC6.3(OUT) ; port PACK1_ON, port PACK2_ON, sheet U_MVM_BMS/PACK_ON_P, sheet U_MVM_BMS/PACK_ON_P
P10V0: C23.1 C24.2 C30.2 C46.2 C47.2 IC6.1(IN) IC10.9(COM) L1.2 LD2.2(A) RL2.1 RL3.1 RL4.1 RL5.1 U4.1(VDD) U4.2(VDD)
B1+: BATH1.1(PLUS) RL2.3(C) RL4.4(NO) ; sheet U_MVM_BMS/Cell2, sheet U_MVM_BMS/PACK_PLUS
B1-: RL2.6(C) RL4.5(NO) ; sheet U_MVM_BMS/PACK_GND
B1_CHG: IC10.3(IN3) ; port B1_CHG
B1_DISCH: IC10.1(IN1) ; port B1_DISCH
B1H: BATH2.1(PLUS) F3.2 ; sheet U_MVM_BMS/Cell1
B1L: BATH3.1(PLUS) F3.1
B2+: BATH5.1(PLUS) RL3.3(C) RL5.4(NO) ; sheet U_MVM_BMS/Cell2, sheet U_MVM_BMS/PACK_PLUS
B2-: RL3.6(C) RL5.5(NO) ; sheet U_MVM_BMS/PACK_GND
B2_CHG: IC10.4(IN4) ; port B2_CHG
B2_DISCH: IC10.2(IN2) ; port B2_DISCH
B2H: BATH6.1(PLUS) F1.2 ; sheet U_MVM_BMS/Cell1
B2L: BATH7.1(PLUS) F1.1
BAT+: D2.1(C) D4.1(C) ; port BAT+
CHRG_ON: T1.1(G) ; port CHRG_ON
CHRG_STATn: T3.3(D) ; port CHRG_STATn
REL1: IC10.16(OUT1) RL2.8
REL2: IC10.15(OUT2) RL3.8
REL3: IC10.14(OUT3) RL4.8
REL4: IC10.13(OUT4) RL5.8
V_BAT_CHG: C31.2 RL4.3(C) RL5.3(C) U4.3(VBAT) U4.4(VBAT) ; port V_BAT_CHG
NetBATH4_1: BATH4.1(PLUS) ; sheet U_MVM_BMS/Cell_GND
NetBATH8_1: BATH8.1(PLUS) ; sheet U_MVM_BMS/Cell_GND
NetC45_2: C45.2 D3.1(C) L1.1 L2.2
NetD2_2: D2.2(A) RL2.4(NO)
NetD4_2: D4.2(A) RL3.4(NO)
NetJ10_1: J10.1 L2.1
NetJ10_2: J10.2 L2.4
NetLD2_1: LD2.1(C) R28.2
NetR27_1: R27.1 U4.10(PROG)
NetR27_2: R27.2 T1.3(D)
NetR28_1: R28.1 T3.1(G) U4.7(STAT)

Not connected (* = marked no-connect by the designer): IC10 5(IN5) 6(IN6) 7(IN7) 10(OUT7) 11(OUT6) 12(OUT5); RL2 2(NC) 7(NC); RL3 2(NC) 7(NC); RL4 2(NC) 7(NC); RL5 2(NC) 7(NC); U4 5(NC) 6(NC)

### Notes on the sheet
- 10V 1A DC IN
- Project/Equipment
- Document
- Designer
- Drawn by
- Check.by
- Copyright WUT ISE 2024.
  This documentation describes Open Hardware and is licensed under the CERN OHL v.2. You may redistribute and modify this documentation under the terms of the CERN OHL v.2. (http://ohwr.org/CERNOHL). This documentation is distributed WITHOUT ANY EXPRESS OR IMPLIED WARRANTY, INCLUDING OF MERCHANTABILITY, SATISFACTORY QUALITY AND FITNESS FOR A PARTICULAR PURPOSE. Please see the CERN OHL v.2 for applicable conditions.
- Contact
- File
- Last Mod.
- Print Date
- Sheet
- Size
- A3
- of
- Rev
- (in symbol CTE3216-18_10UF_10V_10%_LESR1800) +
- (in symbol REL_TYCO_IM06CGR, part A) +

### Library data of the parts
BATH1-BATH8 = BATH_KEYSTONE_54: Battery Holder whit 1 Pin; Part Description: Clip for 16mm - 19mm Diameter Battery; Manufacturer Part Number: 54; PressFit: No; Part Number: BATH_KEYSTONE_54; Component Kind: Standard; Component Type: Standard; Pin Count: 1; PackageDescription: Clip for 16mm - 19mm Diameter Battery; Family: Battery; Mounted: Yes; Socket: No; SMD: No; Sense: No; Manufacturer: KEYSTONE; ComponentHeight: 16.59mm; HelpURL: \\cern.ch\dfs\Applications\Altium\Datasheets\BATH_KEYSTONE_54.pdf; Author: CERN DEM JLC; CreateDate: 21.03.2018; LatestRevisionDate: 21.03.2018
C23 C26 = CTE3216-18_10UF_10V_10%_LESR1800: Polarised capacitor; Part Description: Low ESR 1R8 Solid Tantalum Chip Capacitor; Manufacturer: GENERIC; Manufacturer1 Part Number: TPSA106K010R1800; Voltage: 10V; Tolerance: ±10%; Part Number: CTE3216-18_10UF_10V_10%_LESR1800; Component Kind: Standard; Component Type: Standard; Pin Count: 2; Value: 10uF; Status: Preferred; Manufacturer Part Number: CTE3216-18_10UF_10V_10%_LESR1800; Case: A; Mounted: Yes; Socket: No; SMD: Yes; Sense: No; Manufacturer1 Example: AVX; Manufacturer1 ComponentHeight: 1.8mm; HelpURL: \\cern.ch\dfs\Applications\Altium\Datasheets\CTE-LESR_AVX_TPS.pdf; Author: CERN DEM JLC; CreateDate: 05.05.2008; LatestRevisionDate: 20.01.2009
C24 C25 = CC0805_100NF_50V_1%_NP0: as C9 on sheet mV_meter; Part Number: CC0805_100NF_50V_1%_NP0; Component Kind: Standard; Component Type: Standard; Footprint: CAPC2012X135N; Pin Count: 2; Value: 100nF; Status: Not Recommended; Manufacturer Part Number: CC0805_100NF_50V_1%_NP0; Case: 0805; Mounted: Yes; Socket: No; SMD: Yes; Sense: No; ComponentHeight: 1.35mm; Manufacturer1 Example: WALSIN TECHNOLOGY CORPORATION; Manufacturer1 ComponentHeight: 1.35mm; HelpURL: \\cern.ch\dfs\Applications\Altium\Datasheets\CC0805_WALSIN_0805.pdf; Author: CERN DEM HF; CreateDate: 28.08.2023; LatestRevisionDate: 28.08.2023
C30 C31 = CC0603_1UF_16V_10%_X7R: Non-polarised capacitor; Part Description: SMD Multilayer Chip Ceramic Capacitor; Manufacturer: GENERIC; Manufacturer1 Part Number: 223878615663; Voltage: 16V; TC: X7R; Tolerance: ±10%; Part Number: CC0603_1UF_16V_10%_X7R; Component Kind: Standard; Component Type: Standard; Pin Count: 2; Value: 1uF; Status: None; Manufacturer Part Number: CC0603_1UF_16V_10%_X7R; Case: 0603; Mounted: Yes; Socket: No; SMD: Yes; Sense: No; Manufacturer1 Example: YAGEO PHYCOMP; Manufacturer1 ComponentHeight: 0.9mm; HelpURL: \\cern.ch\dfs\Applications\Altium\Datasheets\CC0603_X7R_PHYCOMP.pdf; Author: CERN DEM JLC; CreateDate: 03.12.2007; LatestRevisionDate: 17.04.2015
C45-C47 = CC1206_22UF_10V_10%_X7R: Non-polarised capacitor; Part Description: SMD Multilayer Chip Ceramic Capacitor; Manufacturer: GENERIC; Manufacturer1 Part Number: GRM31CR71A226KE15L; Voltage: 10V; TC: X7R; Tolerance: ±10%; Part Number: CC1206_22UF_10V_10%_X7R; Component Kind: Standard; Component Type: Standard; Pin Count: 2; Value: 22uF; Status: Preferred; Manufacturer Part Number: CC1206_22UF_10V_10%_X7R; Case: 1206; Mounted: Yes; Socket: No; SMD: Yes; Sense: No; Manufacturer1 Example: MURATA; Manufacturer1 ComponentHeight: 1.8mm; HelpURL: \\cern.ch\dfs\Applications\Altium\Datasheets\CC1206_X7R_MURATA_GRM-HI-CAP.pdf; Author: CERN DEM JLC; CreateDate: 08.06.2010; LatestRevisionDate: 08.06.2010
D2 D4 = SS24FL: Schottky Diode; Part Description: Surface Mount Schottky Barrier Rectifier; Manufacturer: ON SEMICONDUCTOR; Voltage: 40V; Power: 2A; PressFit: No; Bonding: No; Part Number: SS24FL; Component Kind: Standard; Component Type: Standard; Device: SS24FL; PackageDescription: SODFL Diode (SOD123FL); 2.75mm W X 1.72mm L X 1.08mm H body, IPC Medium Density; Manufacturer Part Number: SS24FL; Pin Count: 2; Case: SOD-123FL; Mounted: Yes; Socket: No; SMD: Yes; Sense: No; ComponentHeight: 1.08mm; HelpURL: \\cern.ch\dfs\Applications\Altium\Datasheets\SS24FL.pdf; Author: CERN DEM BC; CreateDate: 06.10.2020; LatestRevisionDate: 06.10.2020
D3 = SMBJ12A: Zener Diode; Part Description: Uni-Directional Transient Voltage Suppressor Diode; Manufacturer: FAIRCHILD SEMICONDUCTOR; Voltage: 12V; Power: 600W; PressFit: No; Bonding: No; Part Number: SMBJ12A; Component Kind: Standard; Component Type: Standard; Device: SMBJ12A; PackageDescription: DO-214-AA/SMB Diode, Molded Body; 5.34mm L X 3.625mm W X 2.65mm H, IPC Medium Density; Manufacturer Part Number: SMBJ12A; Pin Count: 2; Case: DO-214AA; Mounted: Yes; Socket: No; SMD: Yes; Sense: No; ComponentHeight: 2.65mm; HelpURL: \\cern.ch\dfs\Applications\Altium\Datasheets\SMBJ.pdf; Author: CERN DEM JLC; CreateDate: 10.04.2013; LatestRevisionDate: 10.04.2013
F1 F3 = FUSR_BOURNS_MF-SM300-2: Fuse; Part Description: PTC Resettable Fuse; Manufacturer: BOURNS; PressFit: No; Part Number: FUSR_BOURNS_MF-SM300-2; Component Kind: Standard; Component Type: Standard; Pin Count: 2; PackageDescription: PolySwitch, 2-Leads, Body 7.35x5.12mm Nominal; Family: Fuses Resettable; Mounted: Yes; Socket: No; SMD: Yes; Sense: No; Value: 3A-6V; Manufacturer Part Number: MF-SM300-2; ComponentHeight: 3mm; HelpURL: \\cern.ch\dfs\Applications\Altium\Datasheets\FUSR_BOURNS_MF-SM300-2.pdf; Author: CERN DEM JLC; CreateDate: 15.08.2013; LatestRevisionDate: 15.08.2013
IC6 = MC78M05CTG_v: 3-Terminal Regulator 1=IN 2=GND 3=OUT; Part Description: 3-Terminal 5V 500mA Positive Voltage Regulator; Manufacturer: ON SEMICONDUCTOR; PressFit: No; Bonding: No; Part Number: MC78M05CTG_v; Component Kind: Standard; Component Type: Standard; Device: MC78M05CTG; PackageDescription: TO-220 3-Terminal - Vertical Mount; Manufacturer Part Number: MC78M05CT; Pin Count: 4; Case: TO-220; Mounted: Yes; Socket: No; SMD: No; Sense: No; ComponentHeight: 19.68mm; HelpURL: \\cern.ch\dfs\Applications\Altium\Datasheets\MC78M05CTG.pdf; Author: CERN DEM JLC; CreateDate: 08.03.2018; LatestRevisionDate: 24.05.2022
IC10 = ULN2003AD: High-Voltage High-Current Darlington Array; Manufacturer: TEXAS INSTRUMENTS; PressFit: No; Bonding: No; Part Number: ULN2003AD; Component Kind: Standard; Component Type: Standard; Device: ULN2003AD; PackageDescription: SOIC 16, Pitch 1.27mm - Body 4x10mm, IPC Medium Density; Part Description: High-Voltage High-Current Darlington Array; Manufacturer Part Number: ULN2003AD; Pin Count: 16; Case: SOIC16; Mounted: Yes; Socket: No; SMD: Yes; Sense: No; ComponentHeight: 1.75mm; Author: CERN DEM JLC; HelpURL: \\cern.ch\dfs\Applications\Altium\Datasheets\ULN2003AD.pdf; CreateDate: 04.08.2009; LatestRevisionDate: 04.08.2009
J10 = PHOENIX_1803277: Connector 2 Male; Part Description: 8A 160 V, Pitch: 3.81mm, 2 Positions  Right Angled Header; Manufacturer: PHOENIX CONTACT; Manufacturer Part Number: 1803277 (MC 1,5/ 2-G-3,81); PressFit: No; Part Number: PHOENIX_1803277; Component Kind: Standard; Component Type: Standard; Pin Count: 2; Mounted: Yes; Socket: No; SMD: No; Sense: No; Status: None; ComponentHeight: 7.25mm; HelpURL: \\cern.ch\dfs\Applications\Altium\Datasheets\PHOENIX_1803277.pdf; Author: CERN DEM JLC; CreateDate: 06.05.2014; LatestRevisionDate: 06.05.2014
L1 = IND_47UH_20%_WURTH_WE-LHMI_74437349470: Inductor With Core; Part Description: SMD Power Inductor (WE-LHMI Series); Manufacturer: WURTH ELEKTRONIK; Power: 1.45A; Resistance: 0.290R; Tolerance: ±20%; Part Number: IND_47UH_20%_WURTH_WE-LHMI_74437349470; Component Kind: Standard; Component Type: Standard; Pin Count: 2; Value: 47uH; Manufacturer Part Number: 74437349470; Mounted: Yes; Socket: No; SMD: Yes; Sense: No; ComponentHeight: 5mm; HelpURL: \\cern.ch\dfs\Applications\Altium\Datasheets\IND_WURTH_WE-LHMI_74437349470.pdf; Author: CERN DEM HF; CreateDate: 22.11.2023; LatestRevisionDate: 22.11.2023
L2 = IND_1MH_40%_BOURNS_SRF1006: Inductor Common Mode; Part Description: Line Filter, Common Mode Choke; Manufacturer: BOURNS; Manufacturer Part Number: SRF1006-102Y; Power: 0.95A; Resistance: 0.180R; Tolerance: ±40%; Part Number: IND_1MH_40%_BOURNS_SRF1006; Component Kind: Standard; Component Type: Standard; Pin Count: 2; Value: 1mH; Mounted: Yes; Socket: No; SMD: Yes; Sense: No; ComponentHeight: 6.5mm; HelpURL: \\cern.ch\dfs\Applications\Altium\Datasheets\IND_BOURNS_SRF1006.pdf; Author: CERN DEM HF; CreateDate: 30.01.2024; LatestRevisionDate: 30.01.2024
LD2 = LED_AVAGO_HSME-C110: as LD1 on sheet mV_meter; Part Number: LED_AVAGO_HSME-C110; Component Kind: Standard; Component Type: Standard; Color: Green; PackageDescription: Green Chip LED, 2-Leads, Body 3.3x1.6mm, Side Emitting Package; Manufacturer Part Number: HSME-C110; Pin Count: 2; Case: 1206; Mounted: Yes; Socket: No; SMD: Yes; Sense: No; ComponentHeight: 1.1mm; HelpURL: \\cern.ch\dfs\Applications\Altium\Datasheets\LED_AVAGO_HSME-C110.pdf; ComponentLink1URL: \\cern.ch\dfs\Applications\Altium\Datasheets\LED_AVAGO_HSME-C110_DESIGN-GUIDE.pdf; ComponentLink1Description: Design Guide; Author: CERN DEM JMW; CreateDate: 30.07.2009; LatestRevisionDate: 20.06.2012
R27 R28 = R0603_1K_1%_0.1W_100PPM: as R69 on sheet mV_meter; Part Number: R0603_1K_1%_0.1W_100PPM; Component Kind: Standard; Component Type: Standard; Pin Count: 2; Value: 1k; Status: Preferred; Manufacturer Part Number: R0603_1K_1%_0.1W_100PPM; Case: 0603; Mounted: Yes; Sense: No; Socket: No; SMD: Yes; Manufacturer1 Example: NIC COMPONENT; Manufacturer1 ComponentHeight: 0.55mm; HelpURL: \\cern.ch\dfs\Applications\Altium\Datasheets\R0603_NIC_NRC.pdf; Author: CERN DEM JLC; CreateDate: 03.12.2007; LatestRevisionDate: 13.03.2008
RL2 RL4 RL5 = REL_TYCO_IM06CGR: IM Signal Relay (Monostable 1 Coil Non-latching); Part Description: 2A/250VAC, DPDT  (2 Form C) SMT High Dielectric Signal Relay, IM Series; Manufacturer: TYCO AXICOM; Manufacturer Part Number: IM06CGR or 9-1462037-9; PressFit: No; Value: 12VDC; Sense Comment: Cleaning Limitation; Status Comment: Sensitive (See Sensitive Field); Part Number: REL_TYCO_IM06CGR; Component Kind: Standard; Component Type: Standard; Pin Count: 8; PackageDescription: 8 Gull Wings Leads SMT Relay, IM Series, Body 10mm x 6mm; Mounted: Yes; Socket: No; SMD: Yes; Sense: Yes; Status: Not Recommended; ComponentHeight: 5.65mm; HelpURL: \\cern.ch\dfs\Applications\Altium\Datasheets\REL_TYCO_IM06CGR.pdf; Author: CERN DEM JLC; CreateDate: 04.12.2013; LatestRevisionDate: 04.12.2013
RL3 = REL_TYCO_IM06CGR: IM Signal Relay (Monostable 1 Coil Non-latching); Part Description: 2A/250VAC, DPDT  (2 Form C) SMT High Dielectric Signal Relay, IM Series; Manufacturer: TYCO AXICOM; Manufacturer Part Number: IM06CGR or 9-1462037-9; PressFit: No; Sense Comment: Cleaning Limitation; Status Comment: Sensitive (See Sensitive Field); Part Number: REL_TYCO_IM06CGR; Component Kind: Standard; Component Type: Standard; Pin Count: 8; PackageDescription: 8 Gull Wings Leads SMT Relay, IM Series, Body 10mm x 6mm; Mounted: Yes; Socket: No; SMD: Yes; Sense: Yes; Status: Not Recommended; ComponentHeight: 5.65mm; HelpURL: \\cern.ch\dfs\Applications\Altium\Datasheets\REL_TYCO_IM06CGR.pdf; Author: CERN DEM JLC; CreateDate: 04.12.2013; LatestRevisionDate: 04.12.2013
T1 T3 = BSS138LT1G: N-CHANNEL MOSFET WITH DIODE; Part Description: 50V, 200mA N-Channel Enhancement Mode Field-Effect Transistor; Manufacturer: ON SEMICONDUCTOR; PressFit: No; Bonding: No; Part Number: BSS138LT1G; Component Kind: Standard; Component Type: Standard; Device: BSS138LT1G; PackageDescription: SOT23, 0.95mm Pitch; 3 Pin, 1.40mm W X 3.00mm L X 1.10mm H body, IPC Medium Density; Manufacturer Part Number: BSS138L; Pin Count: 3; Case: SOT23-3; Mounted: Yes; Socket: No; SMD: Yes; Sense: No; ComponentHeight: 1.11mm; HelpURL: \\cern.ch\dfs\Applications\Altium\Datasheets\BSS138LT1G.pdf; Author: CERN DEM JLC; CreateDate: 23.03.2009; LatestRevisionDate: 25.05.2022
U4 = CMP-0133-00131-2: IC LI-ION/LI-POLY CTRLR 10-DFN; Number of Cells: 2; Max Input Voltage: 18V; Output Voltage: 8.4V; Max Supply Voltage: 13V; Operating Supply Current: 700uA; Drain to Source Resistance: 350mR; Max Output Current: 1.1A; Min Output Voltage: 8.15V; Voltage Rating: 8.85V; Min Supply Voltage: 4.2V; Radiation Hardening: No; Max Operating Temperature: 85°C; Mount: Surface Mount; Height: 0.037inch; REACH SVHC: No SVHC; Max Charge Current: 1.1A; Packaging: Rail/Tube; Number of Pins: 10; Package Quantity: 120; Case/Package: DFN; Max Output Voltage: 8.85V; Min Operating Temperature: -40°C; Length: 0.118inch; Number of Channels: 2; Width: 0.118inch; Lead Free: Lead Free

## Sheet MVM_BMS.SchDoc: Title
size 420 x 297 mm; Author: G.Kasprowicz; CompanyName: WUT ISE; DrawnBy: G.Kasprowicz; Organization: WUT ISE; Address1: PW ISE; Address2: Nowowiejska 15/19 00-665 Warsaw; Address3: gkasprow@gmail.com; Revision: 2; SheetNumber: 3; SheetTotal: 5; ModifiedBy: -; CheckedDate: -; Title2: Title 2; DivGrp: WUT ISE; Designer: G.Kasprowicz; ModifiedDate: -; ProjectName: Sensor Box
Used 2 times, as channels U_MVM_PSU/U_MVM_BMS, U_MVM_PSU/U_MVM_BMS. Parts and nets are listed once, with the designators drawn on the sheet.
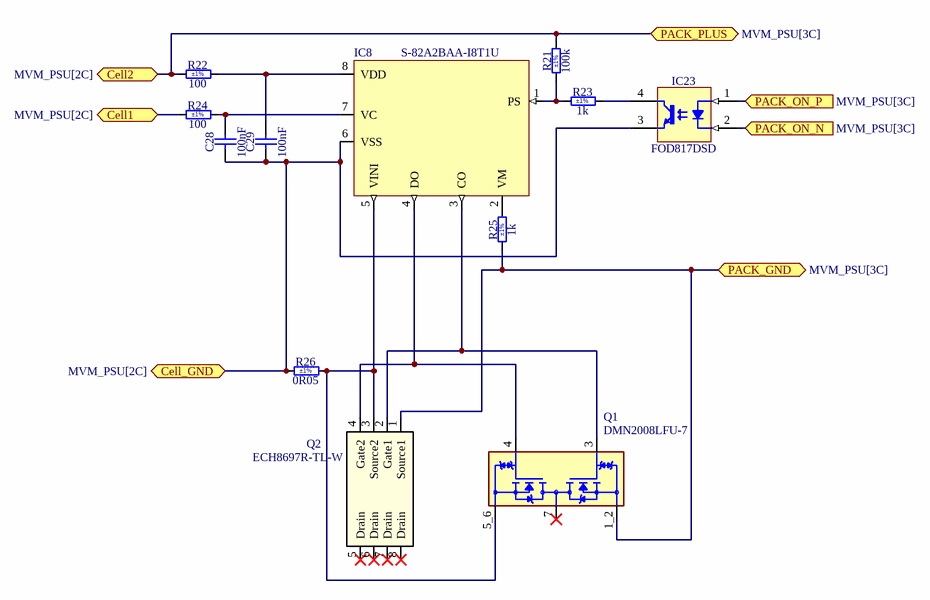
[diagram p2: MVM_BMS.SchDoc]

### Parts
C28  100nF  [CAPC2012X88N]
C29  100nF  [CAPC2012X88N]
IC8  S-82A2BAA-I8T1U  [SON50P200X48-8N]
IC23  FOD817DSD  [FAIRCHILD_FOD817DSD]
Q1  DMN2008LFU-7  [TRANS_DMN2008LFU-7]
Q2  ECH8697R-TL-W  [SOT-28FL-8_2P9X2P3_ONS-M]
R21  100k  Tolerance: ±1%  [RESC1608X55N]
R22  100  Tolerance: ±1%  [RESC1608X55N]
R23  1k  Tolerance: ±1%  [RESC1608X55N]
R24  100  Tolerance: ±1%  [RESC1608X55N]
R25  1k  Tolerance: ±1%  [RESC1608X55N]
R26  0R05  Tolerance: ±1%  [RESC2012X60N]

### Ports
Cell1 (bidir, see MVM_PSU[2C]), Cell2 (bidir, see MVM_PSU[2C]), Cell_GND (bidir, see MVM_PSU[2C]), PACK_GND (bidir, see MVM_PSU[3C]), PACK_ON_N (in, see MVM_PSU[3C]), PACK_ON_P (in, see MVM_PSU[3C]), PACK_PLUS (bidir, see MVM_PSU[3C])

### Nets
Cell1: R24.1 ; port Cell1
Cell2: R21.2 R22.1 ; port Cell2, port PACK_PLUS
Cell_GND: C28.1 C29.1 IC8.6(VSS) IC23.3(E) R26.1 ; port Cell_GND
PACK_GND: Q1.1_2(S1) Q2.1(Source1) R25.1 ; port PACK_GND
PACK_ON_N: IC23.2(C) ; port PACK_ON_N
PACK_ON_P: IC23.1(A) ; port PACK_ON_P
NetC28_2: C28.2 IC8.7(VC) R24.2
NetC29_2: C29.2 IC8.8(VDD) R22.2
NetIC8_1: IC8.1(PS) R21.1 R23.1
NetIC8_2: IC8.2(VM) R25.2
NetIC8_3: IC8.3(CO) Q1.3(G1) Q2.2(Gate1)
NetIC8_4: IC8.4(DO) Q1.4(G2) Q2.4(Gate2)
NetIC8_5: IC8.5(VINI) Q1.5_6(S2) Q2.3(Source2) R26.2
NetIC23_4: IC23.4(C) R23.2

Not connected (* = marked no-connect by the designer): Q1 7(D)*; Q2 5(Drain)* 6(Drain)* 7(Drain)* 8(Drain)*

### Channels
U_MVM_PSU/U_MVM_BMS: designators end in A; ports Cell1=B1H Cell2=B1+ Cell_GND=NetBATH4_1 PACK_GND=B1- PACK_ON_N=GND PACK_ON_P=P5V0 PACK_PLUS=B1+
U_MVM_PSU/U_MVM_BMS: designators end in B; ports Cell1=B2H Cell2=B2+ Cell_GND=NetBATH8_1 PACK_GND=B2- PACK_ON_N=GND PACK_ON_P=P5V0 PACK_PLUS=B2+

### Notes on the sheet
- Project/Equipment
- Document
- Designer
- Drawn by
- Check.by
- Copyright WUT ISE 2024.
  This documentation describes Open Hardware and is licensed under the CERN OHL v.2. You may redistribute and modify this documentation under the terms of the CERN OHL v.2. (http://ohwr.org/CERNOHL). This documentation is distributed WITHOUT ANY EXPRESS OR IMPLIED WARRANTY, INCLUDING OF MERCHANTABILITY, SATISFACTORY QUALITY AND FITNESS FOR A PARTICULAR PURPOSE. Please see the CERN OHL v.2 for applicable conditions.
- Contact
- File
- Last Mod.
- Print Date
- Sheet
- Size
- A3
- of
- Rev

### Library data of the parts
C28 C29 = CC0805_100NF_50V_1%_NP0: as C9 on sheet mV_meter; Part Number: CC0805_100NF_50V_1%_NP0; Component Kind: Standard; Component Type: Standard; Footprint: CAPC2012X135N; Pin Count: 2; Value: 100nF; Status: Not Recommended; Manufacturer Part Number: CC0805_100NF_50V_1%_NP0; Case: 0805; Mounted: Yes; Socket: No; SMD: Yes; Sense: No; ComponentHeight: 1.35mm; Manufacturer1 Example: WALSIN TECHNOLOGY CORPORATION; Manufacturer1 ComponentHeight: 1.35mm; HelpURL: \\cern.ch\dfs\Applications\Altium\Datasheets\CC0805_WALSIN_0805.pdf; Author: CERN DEM HF; CreateDate: 28.08.2023; LatestRevisionDate: 28.08.2023
IC8 = PM_S-82A2BAA-I8T1U: BATTERY PROTECTION IC / FOR 2-SERIAL-CELL PACK; Manufacturer: ABLIC; Manufacturer Part Number: S-82A2BAA-I8T1U
IC23 = FOD817DSD: as IC9 on sheet mV_meter; Part Number: FOD817DSD; Component Kind: Standard; Component Type: Standard; Device: FOD817DSD; PackageDescription: SOIC, 2.54mm Pitch; 4 Pin, 6.50mm W X 4.60mm L X 4.60mm H body; Manufacturer Part Number: FOD817DSD; Pin Count: 4; Case: SOIC4; Mounted: Yes; Socket: No; SMD: Yes; Sense: No; ComponentHeight: 4.6mm; HelpURL: \\cern.ch\dfs\Applications\Altium\Datasheets\FOD817DSD.pdf; Author: CERN DEM JLC; CreateDate: 21.07.2014; LatestRevisionDate: 21.07.2014
Q1 = Q_DMN2008LFU-7: Mosfet Array 2 N-Channel (Dual) Common Drain 20V 14.5A 1W Surface Mount U-DFN2030-6 (Type B); MF: Diodes Inc.; Package: UFDFN-6 Diodes Inc.; Digi-Key_Part_Number: DMN2008LFU-7DICT-ND; Value: *; SnapEDA_Link: https://www.snapeda.com/parts/DMN2008LFU-7/Diodes%20Inc./view-part/612914/?ref=snap; Check_prices: https://www.snapeda.com/parts/DMN2008LFU-7/Diodes%20Inc./view-part/612914/?ref=eda; Purchase-URL: https://pricing.snapeda.com/search/part/DMN2008LFU-7/?ref=eda; MP: DMN2008LFU-7
Q2 = Q_ECH8697R-TL-W: No Description Available; Vendor: ON Semiconductor; Built_By: EMA_Molly; SourceLibrary: OnSemi_2021-05-28_2; Type: DEV; Manufacturer_Part_Number: ECH8697R-TL-W; Copyright: Copyright (C) 2018 Accelerated Designs. All rights reserved; RefDes: RefDes
R21 = R0603_100K_1%_0.1W_100PPM: Resistor - 1%; Part Description: General Purpose Thick Film Chip Resistor; Manufacturer: GENERIC; Manufacturer1 Part Number: NRC06F1003TRF; Power: 0.1W; TC: ±100ppm/°C; PressFit: No; Part Number: R0603_100K_1%_0.1W_100PPM; Component Kind: Standard; Component Type: Standard; Pin Count: 2; Value: 100k; Status: Preferred; Manufacturer Part Number: R0603_100K_1%_0.1W_100PPM; Case: 0603; Mounted: Yes; Sense: No; Socket: No; SMD: Yes; Manufacturer1 Example: NIC COMPONENT; Manufacturer1 ComponentHeight: 0.55mm; HelpURL: \\cern.ch\dfs\Applications\Altium\Datasheets\R0603_NIC_NRC.pdf; Author: CERN DEM JLC; CreateDate: 03.12.2007; LatestRevisionDate: 13.03.2008
R22 R24 = R0603_100R_1%_0.1W_100PPM: Resistor - 1%; Part Description: General Purpose Thick Film Chip Resistor; Manufacturer: GENERIC; Manufacturer1 Part Number: NRC06F4700TRF; Power: 0.1W; TC: ±100ppm/°C; PressFit: No; Part Number: R0603_100R_1%_0.1W_100PPM; Component Kind: Standard; Component Type: Standard; Pin Count: 2; Value: 100; Status: Preferred; Manufacturer Part Number: R0603_100R_1%_0.1W_100PPM; Case: 0603; Mounted: Yes; Sense: No; Socket: No; SMD: Yes; Manufacturer1 Example: NIC COMPONENT; Manufacturer1 ComponentHeight: 0.55mm; HelpURL: \\cern.ch\dfs\Applications\Altium\Datasheets\R0603_NIC_NRC.pdf; Author: CERN DEM JLC; CreateDate: 03.12.2007; LatestRevisionDate: 13.03.2008
R23 R25 = R0603_1K_1%_0.1W_100PPM: as R69 on sheet mV_meter; Part Number: R0603_1K_1%_0.1W_100PPM; Component Kind: Standard; Component Type: Standard; Pin Count: 2; Value: 1k; Status: Preferred; Manufacturer Part Number: R0603_1K_1%_0.1W_100PPM; Case: 0603; Mounted: Yes; Sense: No; Socket: No; SMD: Yes; Manufacturer1 Example: NIC COMPONENT; Manufacturer1 ComponentHeight: 0.55mm; HelpURL: \\cern.ch\dfs\Applications\Altium\Datasheets\R0603_NIC_NRC.pdf; Author: CERN DEM JLC; CreateDate: 03.12.2007; LatestRevisionDate: 13.03.2008
R26 = R0805_0R05_1%_0.25W_300PPM: Resistor - 1%; Part Description: Low Resistance Thick Film Chip Resistor; Manufacturer: GENERIC; Manufacturer1 Part Number: 235051117500L or RL0805FR-7W0R05L; Power: 0.25W; TC: ±300ppm/°C; PressFit: No; Part Number: R0805_0R05_1%_0.25W_300PPM; Component Kind: Standard; Component Type: Standard; Pin Count: 2; Value: 0R05; Status: Not Recommended; Manufacturer Part Number: R0805_0R05_1%_0.25W_300PPM; Case: 0805; Mounted: Yes; Sense: No; Socket: No; SMD: Yes; Manufacturer1 Example: YAGEO PHYCOMP; Manufacturer1 ComponentHeight: 0.60mm; HelpURL: \\cern.ch\dfs\Applications\Altium\Datasheets\R0805_Phycomp_RL0805.pdf; Author: CERN DEM MR; CreateDate: 31.03.2016; LatestRevisionDate: 31.03.2016